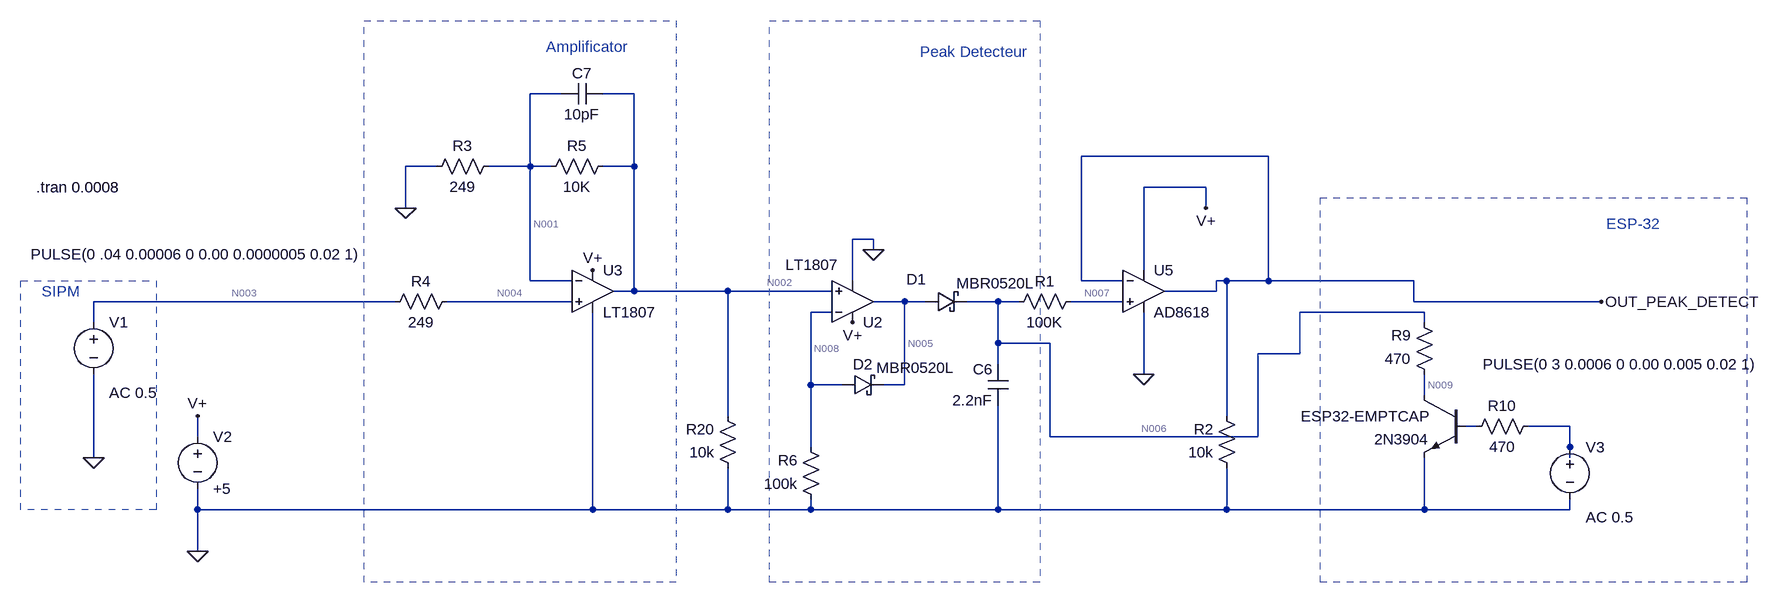
[diagram p0: schematic Muons_V4_b.asc]
Muons_V4_b.asc, the LTspice schematic file:
Version 4
SHEET 1 5945676 13421556
WIRE 624 -368 576 -368
WIRE 736 -368 688 -368
WIRE 1712 -272 1424 -272
WIRE 432 -256 384 -256
WIRE 576 -256 576 -368
WIRE 576 -256 512 -256
WIRE 608 -256 576 -256
WIRE 736 -256 736 -368
WIRE 736 -256 688 -256
WIRE 1616 -224 1520 -224
WIRE 384 -192 384 -256
WIRE 1616 -192 1616 -224
WIRE 1104 -144 1072 -144
WIRE 1104 -128 1104 -144
WIRE 1520 -96 1520 -224
WIRE 576 -80 576 -256
WIRE 640 -80 576 -80
WIRE 1072 -80 1072 -144
WIRE 1424 -80 1424 -272
WIRE 1488 -80 1424 -80
WIRE 1648 -80 1632 -80
WIRE 1712 -80 1712 -272
WIRE 1712 -80 1648 -80
WIRE 1936 -80 1712 -80
WIRE 736 -64 736 -256
WIRE 736 -64 704 -64
WIRE 880 -64 736 -64
WIRE 1040 -64 880 -64
WIRE 1632 -64 1632 -80
WIRE 1632 -64 1552 -64
WIRE 368 -48 -96 -48
WIRE 640 -48 448 -48
WIRE 1152 -48 1104 -48
WIRE 1184 -48 1152 -48
WIRE 1296 -48 1248 -48
WIRE 1328 -48 1296 -48
WIRE 1488 -48 1408 -48
WIRE 1936 -48 1936 -80
WIRE 2224 -48 1936 -48
WIRE 1040 -32 1008 -32
WIRE 1952 -32 1760 -32
WIRE -96 -16 -96 -48
WIRE 1952 -16 1952 -32
WIRE 1296 16 1296 -48
WIRE 1376 16 1296 16
WIRE 1760 32 1760 -32
WIRE 1760 32 1696 32
WIRE 1296 48 1296 16
WIRE 1520 64 1520 -32
WIRE 1008 80 1008 -32
WIRE 1056 80 1008 80
WIRE 1152 80 1152 -48
WIRE 1152 80 1120 80
WIRE 1952 96 1952 64
WIRE 880 128 880 -64
WIRE 1648 128 1648 -80
WIRE 2032 144 2016 144
WIRE 2176 144 2112 144
WIRE 64 160 64 128
WIRE 1376 160 1376 16
WIRE 1696 160 1696 32
WIRE 1696 160 1376 160
WIRE 1008 176 1008 80
WIRE 2176 176 2176 144
WIRE -96 192 -96 64
WIRE 2176 192 2176 176
WIRE 64 272 64 240
WIRE 672 272 672 -32
WIRE 672 272 64 272
WIRE 880 272 880 208
WIRE 880 272 672 272
WIRE 1008 272 1008 256
WIRE 1008 272 880 272
WIRE 1296 272 1296 112
WIRE 1296 272 1008 272
WIRE 1648 272 1648 208
WIRE 1648 272 1296 272
WIRE 1952 272 1952 192
WIRE 1952 272 1648 272
WIRE 2176 272 2176 256
WIRE 2176 272 1952 272
WIRE 64 336 64 272
FLAG -96 192 0
FLAG 64 336 0
FLAG 672 -96 V+
FLAG 64 128 V+
FLAG 384 -192 0
FLAG 2224 -48 OUT_PEAK_DETECT
FLAG 1072 -16 V+
FLAG 1104 -128 0
FLAG 1520 64 0
FLAG 1616 -192 V+
SYMBOL voltage -96 -32 R0
WINDOW 123 24 124 Left 2
WINDOW 39 0 0 Left 0
WINDOW 3 -97 -89 Left 2
SYMATTR Value2 AC 0.5
SYMATTR Value PULSE(0 .04 0.00006 0 0.00 0.0000005 0.02 1)
SYMATTR InstName V1
SYMBOL res 704 -272 R90
WINDOW 0 0 56 VBottom 2
WINDOW 3 32 56 VTop 2
SYMATTR InstName R5
SYMATTR Value 10K
SYMBOL res 464 -64 R90
WINDOW 0 0 56 VBottom 2
WINDOW 3 32 56 VTop 2
SYMATTR InstName R4
SYMATTR Value 249
SYMBOL res 528 -272 R90
WINDOW 0 0 56 VBottom 2
WINDOW 3 32 56 VTop 2
SYMATTR InstName R3
SYMATTR Value 249
SYMBOL cap 688 -384 R90
WINDOW 0 0 32 VBottom 2
WINDOW 3 32 32 VTop 2
SYMATTR InstName C7
SYMATTR Value 10pF
SYMBOL voltage 64 144 R0
WINDOW 123 0 0 Left 0
WINDOW 39 0 0 Left 0
SYMATTR InstName V2
SYMATTR Value +5
SYMBOL res 896 224 R180
WINDOW 0 36 76 Left 2
WINDOW 3 36 40 Left 2
SYMATTR InstName R20
SYMATTR Value 10k
SYMBOL cap 1312 112 R180
WINDOW 0 24 56 Left 2
WINDOW 3 24 8 Left 2
SYMATTR InstName C6
SYMATTR Value 2.2nF
SYMBOL OpAmps\\LT1807 1072 16 M180
WINDOW 3 -103 121 Left 2
SYMATTR InstName U2
SYMBOL OpAmps\\LT1807 672 -128 R0
SYMATTR InstName U3
SYMBOL schottky 1184 -32 R270
WINDOW 0 35 -14 VTop 2
WINDOW 3 60 108 VBottom 2
SYMATTR InstName D1
SYMATTR Value MBR0520L
SYMATTR Description Diode
SYMATTR Type diode
SYMBOL voltage 2176 160 R0
WINDOW 123 24 124 Left 2
WINDOW 39 0 0 Left 0
WINDOW 3 -134 -112 Left 2
SYMATTR Value2 AC 0.5
SYMATTR Value PULSE(0 3 0.0006 0 0.00 0.005 0.02 1)
SYMATTR InstName V3
SYMBOL res 2128 128 R90
WINDOW 0 0 56 VBottom 2
WINDOW 3 32 56 VTop 2
SYMATTR InstName R10
SYMATTR Value 470
SYMBOL npn 2016 96 M0
SYMATTR InstName ESP32-EMPTCAP
SYMATTR Value 2N3904
SYMBOL res 1024 272 R180
WINDOW 0 36 76 Left 2
WINDOW 3 36 40 Left 2
SYMATTR InstName R6
SYMATTR Value 100k
SYMBOL schottky 1056 96 R270
WINDOW 0 32 32 VTop 2
WINDOW 3 58 113 VBottom 2
SYMATTR InstName D2
SYMATTR Value MBR0520L
SYMATTR Description Diode
SYMATTR Type diode
SYMBOL res 1968 80 R180
WINDOW 0 36 76 Left 2
WINDOW 3 36 40 Left 2
SYMATTR InstName R9
SYMATTR Value 470
SYMBOL OpAmps\\AD8618 1520 -128 R0
SYMATTR InstName U5
SYMBOL res 1424 -64 R90
WINDOW 0 0 56 VBottom 2
WINDOW 3 32 56 VTop 2
SYMATTR InstName R1
SYMATTR Value 100K
SYMBOL res 1664 224 R180
WINDOW 0 36 76 Left 2
WINDOW 3 36 40 Left 2
SYMATTR InstName R2
SYMATTR Value 10k
TEXT -184 -224 Left 2 !.tran 0.0008
TEXT 1176 -432 Left 2 ;Peak Detecteur
TEXT 600 -440 Left 2 ;Amplificator
TEXT 2232 -168 Left 2 ;ESP-32
TEXT -176 -64 Left 2 ;SIPM
RECTANGLE Normal 2448 384 1792 -208 2
RECTANGLE Normal 0 272 -208 -80 2
RECTANGLE Normal 1360 384 944 -480 2
RECTANGLE Normal 800 384 320 -480 2

The netlist it stands for:
* Muons_V4_b.asc
V1 N003 0 PULSE(0 .04 0.00006 0 0.00 0.0000005 0.02 1) AC 0.5
R5 N002 N001 10K
R4 N004 N003 249
R3 N001 0 249
C7 N002 N001 10pF
V2 V+ 0 +5
R20 0 N002 10k
C6 0 N006 2.2nF
XU2 N002 N008 V+ 0 N005 LT1807  ; pins In+ In- V+ V- OUT
XU3 N004 N001 V+ 0 N002 LT1807  ; pins In+ In- V+ V- OUT
D1 N005 N006 MBR0520L
V3 N011 0 PULSE(0 3 0.0006 0 0.00 0.005 0.02 1) AC 0.5
R10 N011 N010 470
Q§ESP32-EMPTCAP N009 N010 0 0 2N3904
R6 0 N008 100k
D2 N008 N005 MBR0520L
R9 N009 N006 470
XU5 N007 OUT_PEAK_DETECT V+ 0 OUT_PEAK_DETECT AD8618  ; pins In+ In- V+ V- OUT
R1 N007 N006 100K
R2 0 OUT_PEAK_DETECT 10k
.model D D
.lib standard.dio
.model NPN NPN
.model PNP PNP
.lib standard.bjt
.tran 0.0008
* Peak Detecteur
* Amplificator
* ESP-32
* SIPM
.backanno
.end

* Results of the author's LTspice run, read from the files saved beside the schematic
* Operating Point, zero values left out:
*   V(n002) = 2.74 mV
*   V(n001) = 1.274 mV
*   V(n004) = 1.237 mV
*   V(v+) = 5 V
*   V(n006) = 1.446 mV
*   V(n008) = 75.35 mV
*   V(n005) = 1.446 mV
*   V(n009) = 1.446 mV
*   V(out_peak_detect) = 2.93 mV
*   V(n007) = 1.446 mV
*   I(D2) = 4.214 µA
*   I(R2) = -293 nA
*   I(R6) = -753.5 nA
*   I(R20) = -274 nA
*   I(R3) = 5.116 µA
*   I(R4) = 4.969 µA
*   I(R5) = 146.6 nA
*   I(V2) = -13.99 mA
*   I(V1) = 4.969 µA
*   Ix(u2:1) = -4.969 µA
*   Ix(u2:2) = -4.968 µA
*   Ix(u2:3) = 6.299 mA
*   Ix(u2:4) = -6.295 mA
*   Ix(u2:5) = 4.214 µA
*   Ix(u3:1) = -4.969 µA
*   Ix(u3:2) = -4.969 µA
*   Ix(u3:3) = 6.315 mA
*   Ix(u3:4) = -6.31 mA
*   Ix(u3:5) = 4.549 µA
*   Ix(u5:99) = 1.373 mA
*   Ix(u5:50) = -1.373 mA
*   Ix(u5:45) = -293 nA
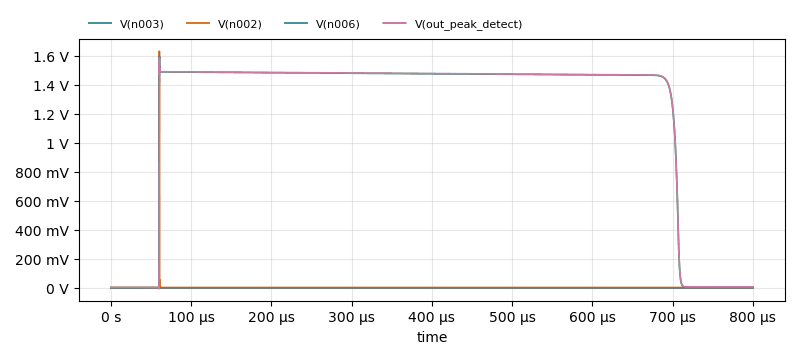
[diagram p1: Transient Analysis of Muons_V4_b.asc, plotted from the saved traces]
* Transient Analysis, 1 run:
*   V(n003): min 0 V, max 40 mV, average 27.5 µV, rms 1.033 mV, last 0 V
*   V(n002): min 2.728 mV, max 1.629 V, average 3.87 mV, rms 38.43 mV, last 2.74 mV
*   V(n006): min 1.283 mV, max 1.591 V, average 1.188 V, rms 1.321 V, last 6.025 mV
*   V(out_peak_detect): min -6.355 mV, max 1.583 V, average 1.19 V, rms 1.323 V, last 7.509 mV